# Altium project RD_BUCK.PrjPcb
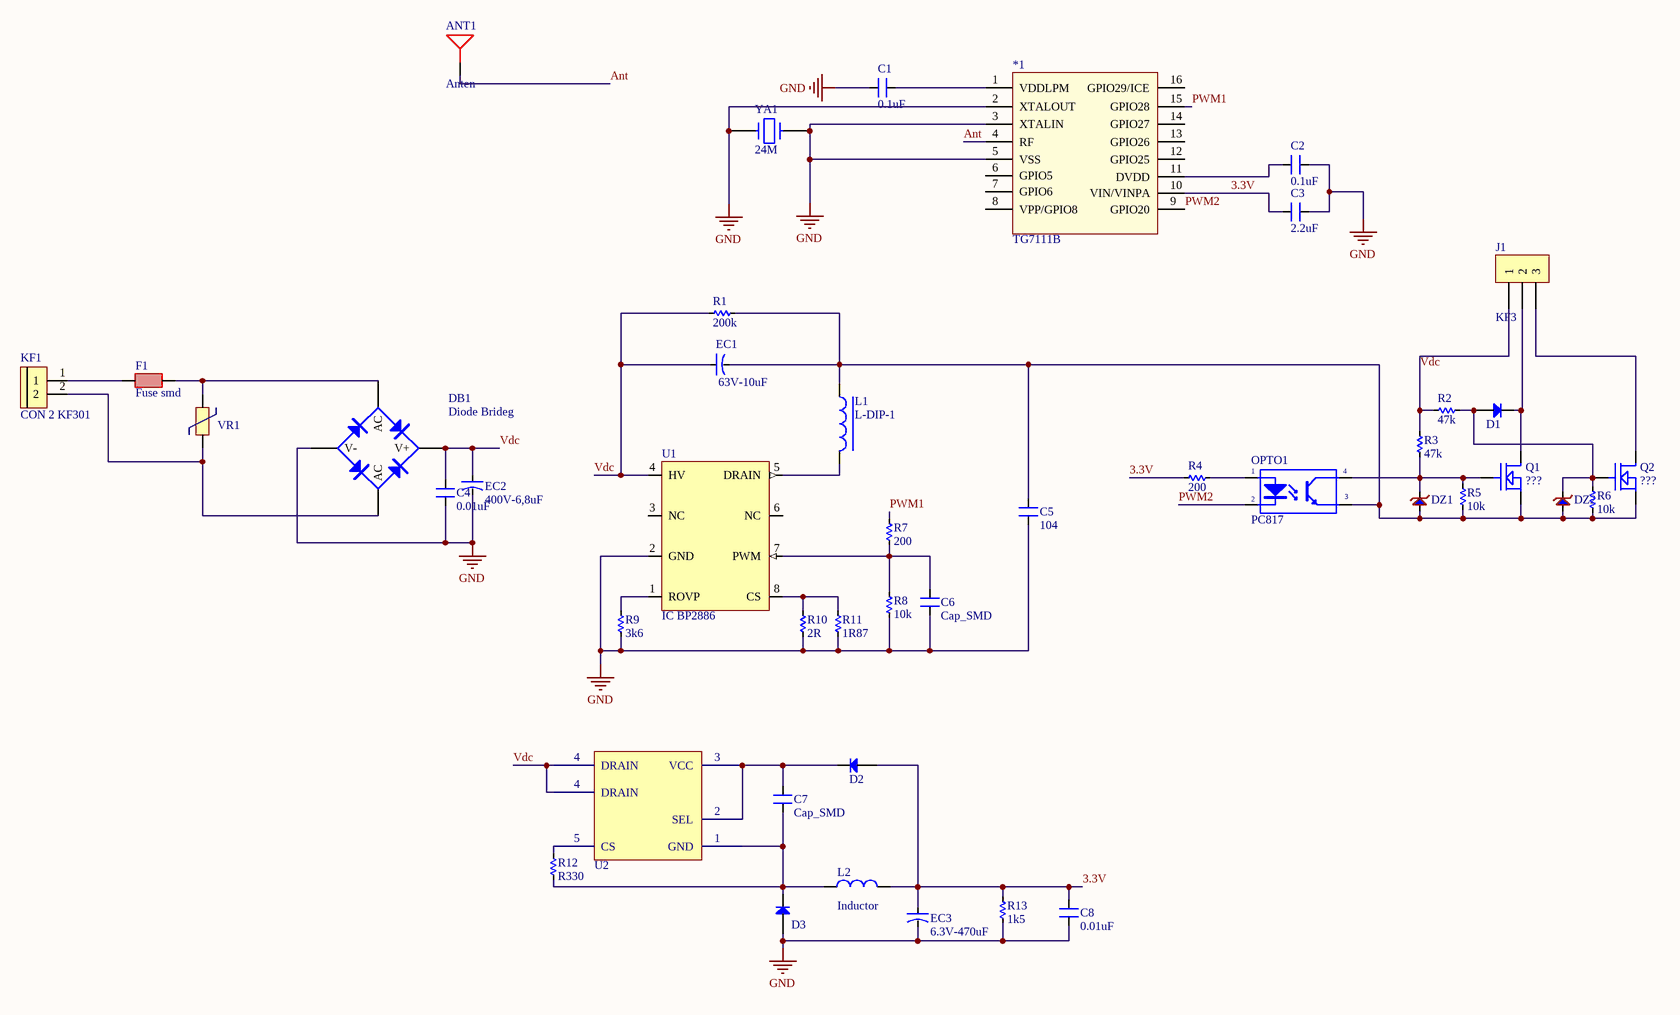
[diagram p0: RD_BUCK.SchDoc]
1 sheet, 44 parts. Net scope: global (net labels, ports and power ports of the same name join across sheets).
Board file: RD_BUCK.PcbDoc

## Sheet RD_BUCK.SchDoc: *RD_BUCK
size A3; SheetNumber: 1; SheetTotal: 1

### Parts
*1  TG7111B  [SO16]
ANT1  Anten  [Anten 2.4GHz 15.7-5.7 - duplicate]
C1  0.1uF  [CN-SMD-0603]
C2  0.1uF  [CN-SMD-0603]
C3  2.2uF  [CN-SMD-0603]
C4  0.01uF  [CN-SMD-0805]
C5  104  [CN-SMD-0603]
C6  Cap_SMD  [CN-SMD-0603]
C7  Cap_SMD  [CN-SMD-0805]
C8  0.01uF  [CN-SMD-0805]
D1  Diode SMD  [DIO-SMD-123]  (value not drawn)
D2  Diode SMD  [DIO-SMD-106]  (value not drawn)
D3  Diode SMD  [DIO-SMD-106]  (value not drawn)
DB1  Diode Brideg  [MD_ABS16_smd]
DZ1  DIODE Zener  [DIO-SMD-123]  (value not drawn)
DZ2  DIODE Zener  [DIO-SMD-123]  (value not drawn)
EC1  63V-10uF  [CAP-ALU-SMD-C]
EC2  400V-6,8uF  [CAP-ALU-SMD-F]
EC3  6.3V-470uF  [CAP-ALU-SMD-F]
F1  Fuse smd  [Fuse_smd]
J1  KF3  [KF3-5.08]
KF1  CON 2 KF301  [Con 2 KF301 5.08]
L1  L-DIP-1  [PCBComponent_1]
L2  Inductor  [L-SMD-M-7.3x4.5]
OPTO1  PC817  [PC817 smd]
Q1  ???  [SOT23-132]
Q2  ???  [SOT23-132]
R1  200k  [RES-SMD-0603]
R2  47k  [RES-SMD-0805]
R3  47k  [RES-SMD-0805]
R4  200  [RES-SMD-0603]
R5  10k  [RES-SMD-0805]
R6  10k  [RES-SMD-0805]
R7  200  [RES-SMD-0603]
R8  10k  [RES-SMD-0603]
R9  3k6  [RES-SMD-0603]
R10  2R  [RES-SMD-0603]
R11  1R87  [RES-SMD-0603]
R12  R330  [RES-SMD-0805]
R13  1k5  [RES-SMD-0603]
U1  IC BP2886  [SO8]
U2  3.3V - 5V  [BP SOT33-5L]  (value not drawn)
VR1  varistor  [CN2]  (value not drawn)
YA1  24M  [XTAL-SMD]

### Nets
GND: *1.2(XTALOUT) *1.3(XTALIN) *1.5(VSS) C1.1 C2.2 C3.2 C4.1 C5.1 C6.1 C8.1 D3.1(A) DB1.4(V-) EC2.2 EC3.2 R8.2 R9.2 R10.2 R11.2 R13.1 U1.2(GND) YA1.1 YA1.2
3.3V: *1.10(VIN/VINPA) C3.1 C8.2 D2.1(A) EC3.1 L2.2 R4.1 R13.2
Ant: *1.4(RF) ANT1.1
PWM1: *1.15(GPIO28) R7.2
PWM2: *1.9(GPIO20) OPTO1.2(K)
Vdc: C4.2 DB1.1(V+) EC1.1 EC2.1 J1.1 R1.1 R2.1 R3.1 U1.4(HV) U2.4(DRAIN)
Net*1_1: *1.1(VDDLPM) C1.2
Net*1_11: *1.11(DVDD) C2.1
NetC5_2: C5.2 DZ1.1(A) DZ2.1(A) EC1.2 L1.1 OPTO1.3(E) Q1.3(S) Q2.3(S) R1.2 R5.2 R6.2
NetC6_2: C6.2 R7.1 R8.1 U1.7(PWM)
NetC7_1: C7.1 D3.2(K) L2.1 R12.2 U2.1(GND)
NetC7_2: C7.2 D2.2(K) U2.2(SEL) U2.3(VCC)
NetD1_1: D1.1(A) DZ2.2(K) Q2.1(G) R2.2 R6.1
NetD1_2: D1.2(K) J1.2 Q1.2(D)
NetDB1_2: DB1.2(AC) F1.2 VR1.2
NetDB1_3: DB1.3(AC) KF1.2 VR1.1
NetDZ1_2: DZ1.2(K) OPTO1.4(C) Q1.1(G) R3.2 R5.1
NetF1_1: F1.1 KF1.1
NetJ1_3: J1.3 Q2.2(D)
NetL1_2: L1.2 U1.5(DRAIN)
NetOPTO1_1: OPTO1.1(A) R4.2
NetR9_1: R9.1 U1.1(ROVP)
NetR10_1: R10.1 R11.1 U1.8(CS)
NetR12_1: R12.1 U2.5(CS)

Not connected (* = marked no-connect by the designer): *1 6(GPIO5) 7(GPIO6) 8(VPP/GPIO8) 12(GPIO25) 13(GPIO26) 14(GPIO27) 16(GPIO29/ICE); U1 3(NC) 6(NC)

### Library data of the parts
ANT1 = Anten: Manufacturer: W¨¹rth Elektronik eiSos GmbH; partNo: 613002143121; ComponentLink1 Description: Manufacturer; ComponentLink2 Description: Datasheet; NoPins: 02; Created Date: 29 March 2013; ComponentLink1URL: http://www.we-online.com; ComponentLink2URL: http://katalog.we-online.de/em/datasheet/6130xx143121.pdf; Created by: Karrer Zheng
C1-C8 = Cap_SMD: Value: 33pF
D1-D3 = Diode SMD: Default Diode; Code - JEDEC: DO-214-AB; Value: 1N5007; Published: 8-Jun-2000; Revision: July-2002: Re-released for DXP Platform.; Publisher: Altium Limited
DB1 = DIODE BRIGDE: Convert AC to DC voltage, 4 pin; Value: Cau 1A
DZ1 DZ2 = DIODE Zener: Zenner
EC1-EC3 = Cap_SMD_AL: Polarized Capacitor (Axial); Published: 8-Jun-2000; LatestRevisionDate: 17-Jul-2002; LatestRevisionNote: Re-released for DXP Platform.; PackageReference: POLAR0.8; Publisher: Altium Limited
F1 = Fuse_smd
J1 = KF3: Manufacturer: Würth Elektronik eiSos GmbH; partNo: 691103110003; ComponentLink1 Description: Manufacturer; ComponentLink2 Description: Datasheet; NoPins: 3; Created Date: 29 October 2013; ComponentLink1URL: http://www.we-online.com; ComponentLink2URL: http://katalog.we-online.de/em/datasheet/6911031100xx.pdf; Created by: Karrer Zheng
KF1 = CON 2 KF301: Cắm; Ma_Hang: MH000987; Ten_Linh_Kien: CON 2 KF301-2P 5.08MM Xanh Dương; Chung_Loai: Cắm; Ghi_Chu: *; Kieu_Chan: *; Don_Vi: Con
L1 = L-DIP-1: Inductor; Value: 150 mH
Q1 Q2 = MOSFET N
R1-R13 = Res-SMD: Resistor; Manufacturer: Generic Components; Class: Passive; Published: 08/06/2000; Publisher: Altium Hobart Technology Centre
U1 = IC BP2886X: Dimmable Non-isolated LFC Buck LED Driver
U2 = IC BP2525X
YA1 = CRYSTAL